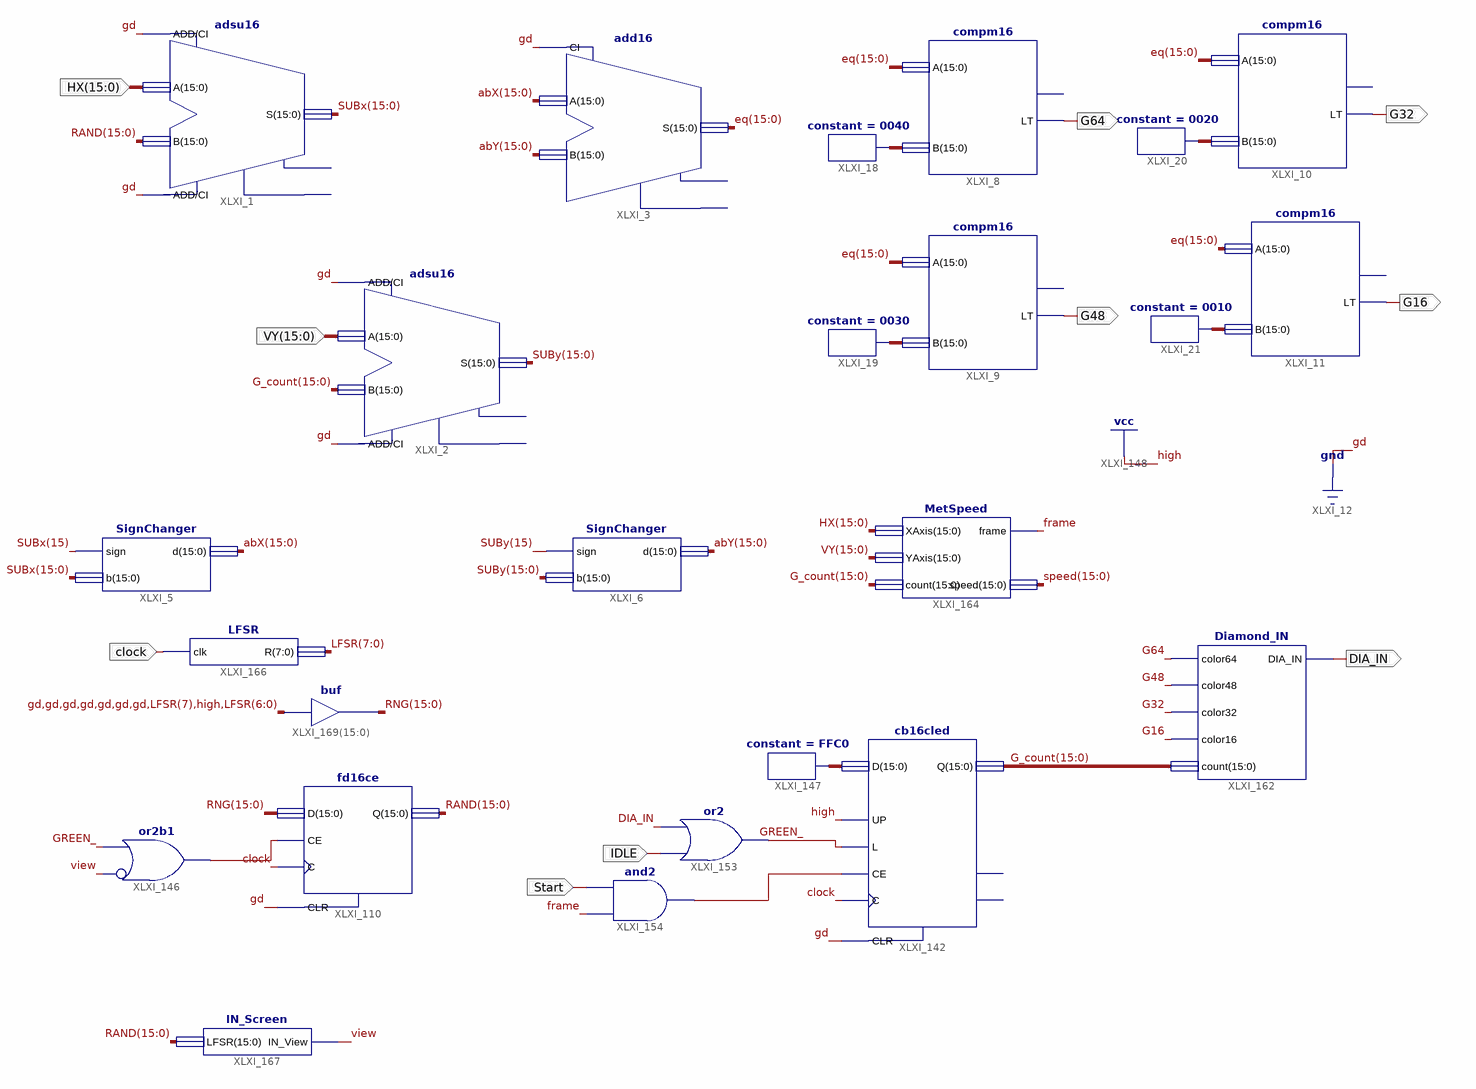
[diagram p0: schematic sheet 1]
// Xilinx ISE schematic GreenMet.sch (spartan3e) as structural Verilog: 24 symbols, 10 ports
module GreenMet (
  input  [15:0] VY,
  input  clock,
  input  [15:0] HX,
  input  Start,
  input  IDLE,
  output G64,
  output G48,
  output G32,
  output G16,
  output DIA_IN
);

  wire frame, GREEN_, view, XLXN_314, XLXN_315;
  wire [7:0] LFSR;
  wire [15:0] abX, abY, eq, G_count, RAND, RNG, speed, SUBx, SUBy, XLXN_6, XLXN_7, XLXN_8, XLXN_9, XLXN_282;

  add16 XLXI_3 (.A(abX), .B(abY), .CI(1'b0), .S(eq));  // open: CO, OFL
  SignChanger XLXI_5 (.sign(SUBx[15]), .b(SUBx), .d(abX));
  SignChanger XLXI_6 (.sign(SUBy[15]), .b(SUBy), .d(abY));
  compm16 XLXI_8 (.A(eq), .B(XLXN_6), .LT(G64));  // open: GT
  constant #(.CValue("0040")) XLXI_18 (.O(XLXN_6));
  compm16 XLXI_9 (.A(eq), .B(XLXN_7), .LT(G48));  // open: GT
  constant #(.CValue("0030")) XLXI_19 (.O(XLXN_7));
  compm16 XLXI_10 (.A(eq), .B(XLXN_8), .LT(G32));  // open: GT
  constant #(.CValue("0020")) XLXI_20 (.O(XLXN_8));
  compm16 XLXI_11 (.A(eq), .B(XLXN_9), .LT(G16));  // open: GT
  constant #(.CValue("0010")) XLXI_21 (.O(XLXN_9));
  fd16ce XLXI_110 (.C(clock), .CE(XLXN_314), .CLR(1'b0), .D(RNG), .Q(RAND));
  or XLXI_146 (XLXN_314, ~view, GREEN_);  // or2b1
  cb16cled XLXI_142 (
    .C(clock), .CE(XLXN_315), .CLR(1'b0), .D(XLXN_282), .L(GREEN_), .UP(1'b1), .Q(G_count));  // open: CEO, TC
  constant #(.CValue("FFC0")) XLXI_147 (.O(XLXN_282));
  and XLXI_154 (XLXN_315, frame, Start);
  or XLXI_153 (GREEN_, IDLE, DIA_IN);
  Diamond_IN XLXI_162 (.color64(G64), .color48(G48), .color32(G32), .color16(G16), .count(G_count), .DIA_IN(DIA_IN));
  adsu16 XLXI_2 (.A(VY), .ADD(1'b0), .B(G_count), .CI(1'b0), .S(SUBy));  // open: CO, OFL
  adsu16 XLXI_1 (.A(HX), .ADD(1'b0), .B(RAND), .CI(1'b0), .S(SUBx));  // open: CO, OFL
  MetSpeed XLXI_164 (.XAxis(HX), .YAxis(VY), .count(G_count), .frame(frame), .speed(speed));
  IN_Screen XLXI_167 (.LFSR(RAND), .IN_View(view));
  LFSR XLXI_166 (.clk(clock), .R(LFSR));
  assign RNG = {{7{1'b0}}, LFSR[7], 1'b1, LFSR[6:0]};  // buf XLXI_169[15..0], 16 bits wide
endmodule
